# Altium schematic sheet AFE4900.SchDoc
size A4
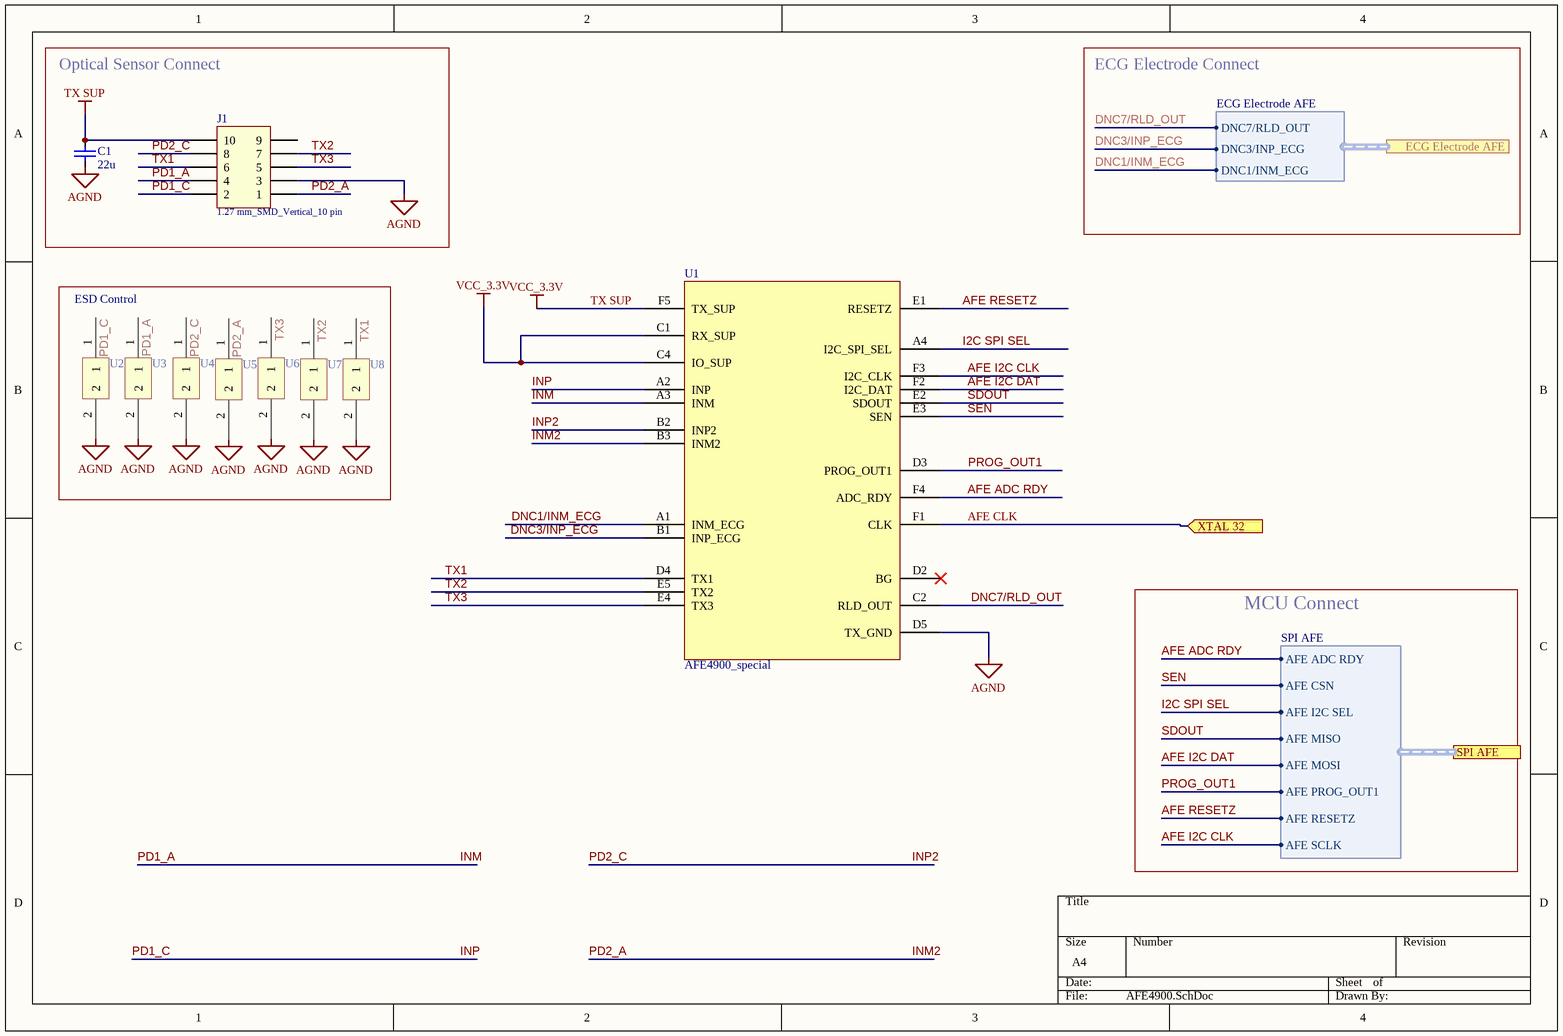
[diagram p0: AFE4900.SchDoc]

## Parts
C1  22u  [CAPC1608X05N]
J1  1.27 mm_SMD_Vertical_10 pin  [62131021021]
U1  AFE4900_special  [AFE4900_Breakout]
U2  TPD1E10B06DPYR  [TPD1E10B06DPYR_0402]  (value not drawn)
U3  TPD1E10B06DPYR  [TPD1E10B06DPYR_0402]  (value not drawn)
U4  TPD1E10B06DPYR  [TPD1E10B06DPYR_0402]  (value not drawn)
U5  TPD1E10B06DPYR  [TPD1E10B06DPYR_0402]  (value not drawn)
U6  TPD1E10B06DPYR  [TPD1E10B06DPYR_0402]  (value not drawn)
U7  TPD1E10B06DPYR  [TPD1E10B06DPYR_0402]  (value not drawn)
U8  TPD1E10B06DPYR  [TPD1E10B06DPYR_0402]  (value not drawn)

## Blocks framed on the sheet
Optical Sensor Connect: C1 J1
ESD Control: U2-U8

## Ports
ECG Electrode AFE (harness ECG Electrode AFE), SPI AFE (harness SPI AFE), XTAL 32 (in)

## Harnesses
ECG Electrode AFE: DNC1/INM_ECG, DNC7/RLD_OUT, DNC3/INP_ECG
SPI AFE: AFE ADC RDY, AFE CSN, AFE I2C SEL, AFE MISO, AFE MOSI, AFE PROG_OUT1, AFE RESETZ, AFE SCLK

## Nets
AGND: C1.1 J1.3 U1.D5(TX_GND) U2.2 U3.2 U4.2 U5.2 U6.2 U7.2 U8.2
TX SUP: C1.2 J1.10 U1.C1(RX_SUP) U1.C4(IO_SUP) U1.F5(TX_SUP)  [also labelled VCC_3.3V]
AFE ADC RDY: U1.F4(ADC_RDY) ; port SPI AFE.AFE ADC RDY
AFE CLK: U1.F1(CLK) ; port XTAL 32
AFE I2C CLK: U1.F3(I2C_CLK) ; port SPI AFE.AFE SCLK
AFE I2C DAT: U1.F2(I2C_DAT) ; port SPI AFE.AFE MOSI
AFE RESETZ: U1.E1(RESETZ) ; port SPI AFE.AFE RESETZ
DNC1/INM_ECG: U1.A1(INM_ECG) ; port ECG Electrode AFE.DNC1/INM_ECG
DNC3/INP_ECG: U1.B1(INP_ECG) ; port ECG Electrode AFE.DNC3/INP_ECG
DNC7/RLD_OUT: U1.C2(RLD_OUT) ; port ECG Electrode AFE.DNC7/RLD_OUT
I2C SPI SEL: U1.A4(I2C_SPI_SEL) ; port SPI AFE.AFE I2C SEL
INM: J1.4 U1.A3(INM) U3.1  [also labelled PD1_A]
INM2: J1.1 U1.B3(INM2) U5.1  [also labelled PD2_A]
INP: J1.2 U1.A2(INP) U2.1  [also labelled PD1_C]
INP2: J1.8 U1.B2(INP2) U4.1  [also labelled PD2_C]
PROG_OUT1: U1.D3(PROG_OUT1) ; port SPI AFE.AFE PROG_OUT1
SDOUT: U1.E2(SDOUT) ; port SPI AFE.AFE MISO
SEN: U1.E3(SEN) ; port SPI AFE.AFE CSN
TX1: J1.6 U1.D4(TX1) U8.1
TX2: J1.7 U1.E5(TX2) U7.1
TX3: J1.5 U1.E4(TX3) U6.1

Not connected (* = marked no-connect by the designer): J1 9; U1 D2(BG)*

## Notes on the sheet
- ECG Electrode Connect
- MCU Connect

## Library data of the parts
C1 = C_22u_0603: Kondensator 22u 0603; Tested: False
J1 = 62131021021: Pin Header WR-PHD, pitch 1.27 mm, SMD, Vertical, dual row, 10 pin; Rated Current: 1 A; Pin Number: 10; Pitch: 1.27 mm; Working Voltage: 100 VAC; Contact Resistance: 20 mOhm; Insulation Resistance: >1000 MOhm; ComponentLink1Description: Manufacturer; ComponentLink1URL: http://www.we-online.de; ComponentLink2Description: Datasheet; ComponentLink2URL: http://katalog.we-online.de/em/datasheet/62131021021.pdf; Part Number: 62131021021; Published Date: Jan. 2018; Publisher: Wurth Elektronik; Operating Temperature: -40 to 105 degC; Mounting Technology: SMD; Row Number: Dual; Orientation: Vertical
U1 = AFE4900_special: Synchronized_ECG_and_PPG_AFE
U2-U8 = TPD1E10B06DPYR: TPD1E10B06DPYR 0402